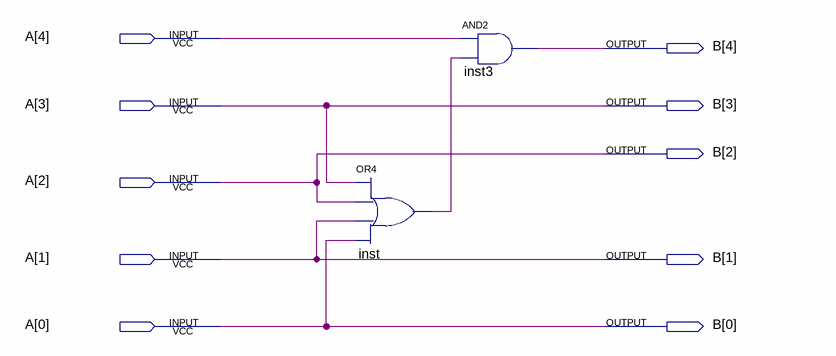
[diagram p0: schematic sheet]
// Quartus schematic ZeroTransformers.bdf as structural Verilog: 2 symbols, 10 pins
module ZeroTransformers (
  input  [4:0] A,
  output [4:0] B
);

  wire inst_out;

  or inst (inst_out, A[3], A[2], A[1], A[0]);
  and inst3 (B[4], A[4], inst_out);

  assign B[3:0] = A[3:0];
endmodule
